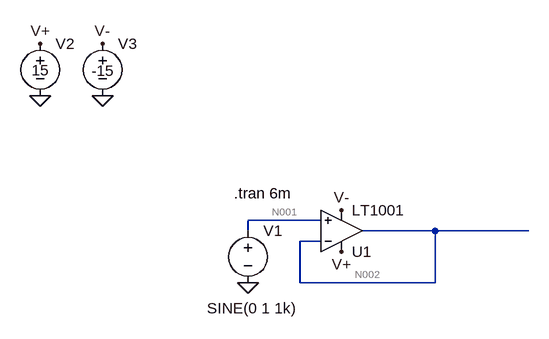
[diagram p0: schematic Jänniteseuraaja.asc]
Jänniteseuraaja.asc, the LTspice schematic file:
Version 4
SHEET 1 880 680
WIRE 176 144 64 144
WIRE 64 160 64 144
WIRE 352 160 240 160
WIRE 496 160 352 160
WIRE 176 176 144 176
WIRE 144 240 144 176
WIRE 352 240 352 160
WIRE 352 240 144 240
FLAG 64 240 0
FLAG -160 -48 0
FLAG -256 -48 0
FLAG 208 192 V+
FLAG 208 128 V-
FLAG -160 -128 V-
FLAG -256 -128 V+
SYMBOL Opamps\\LT1001 208 224 M180
SYMATTR InstName U1
SYMBOL voltage 64 144 R0
WINDOW 3 -63 135 Left 2
WINDOW 123 0 0 Left 2
WINDOW 39 0 0 Left 2
SYMATTR InstName V1
SYMATTR Value SINE(0 1 1k)
SYMBOL voltage -256 -144 R0
WINDOW 3 -13 57 Left 2
WINDOW 123 0 0 Left 2
WINDOW 39 0 0 Left 2
SYMATTR InstName V2
SYMATTR Value 15
SYMBOL voltage -160 -144 R0
WINDOW 3 -17 58 Left 2
WINDOW 123 0 0 Left 2
WINDOW 39 0 0 Left 2
SYMATTR InstName V3
SYMATTR Value -15
TEXT 42 102 Left 2 !.tran 6m

The netlist it stands for:
* Jänniteseuraaja.asc
XU1 N001 N002 V+ V- N002 LT1001  ; pins In+ In- V+ V- OUT
V1 N001 0 SINE(0 1 1k)
V2 V+ 0 15
V3 V- 0 -15
.tran 6m
.lib LTC.lib
.backanno
.end

* Results of the author's LTspice run, read from the files saved beside the schematic
* Operating Point, zero values left out:
*   V(v+) = 15 V
*   V(v-) = -15 V
*   I(V3) = 2.25 mA
*   I(V2) = -2.25 mA
*   Ix(u1:3) = 2.25 mA
*   Ix(u1:4) = -2.25 mA
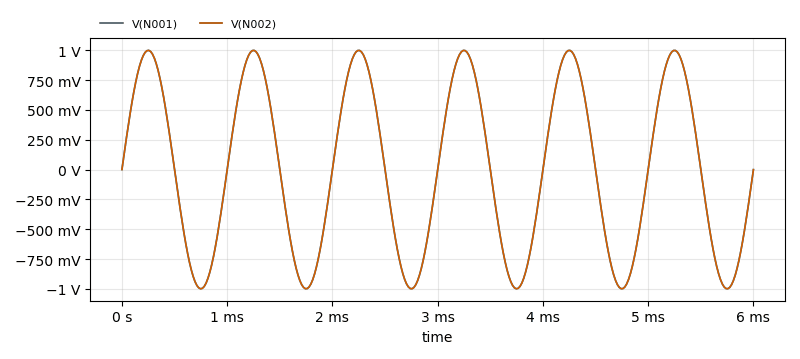
[diagram p1: Transient Analysis of Jänniteseuraaja.asc, plotted from the saved traces]
* Transient Analysis, 1 run:
*   V(N001): min -999.5 mV, max 999.2 mV, average 217.2 nV, rms 706.9 mV, last 0 V
*   V(N002): min -999.5 mV, max 999.2 mV, average 223.4 nV, rms 706.9 mV, last -1.173 mV